# EAGLE schematic v1_0 (EAGLE 8.0.1)
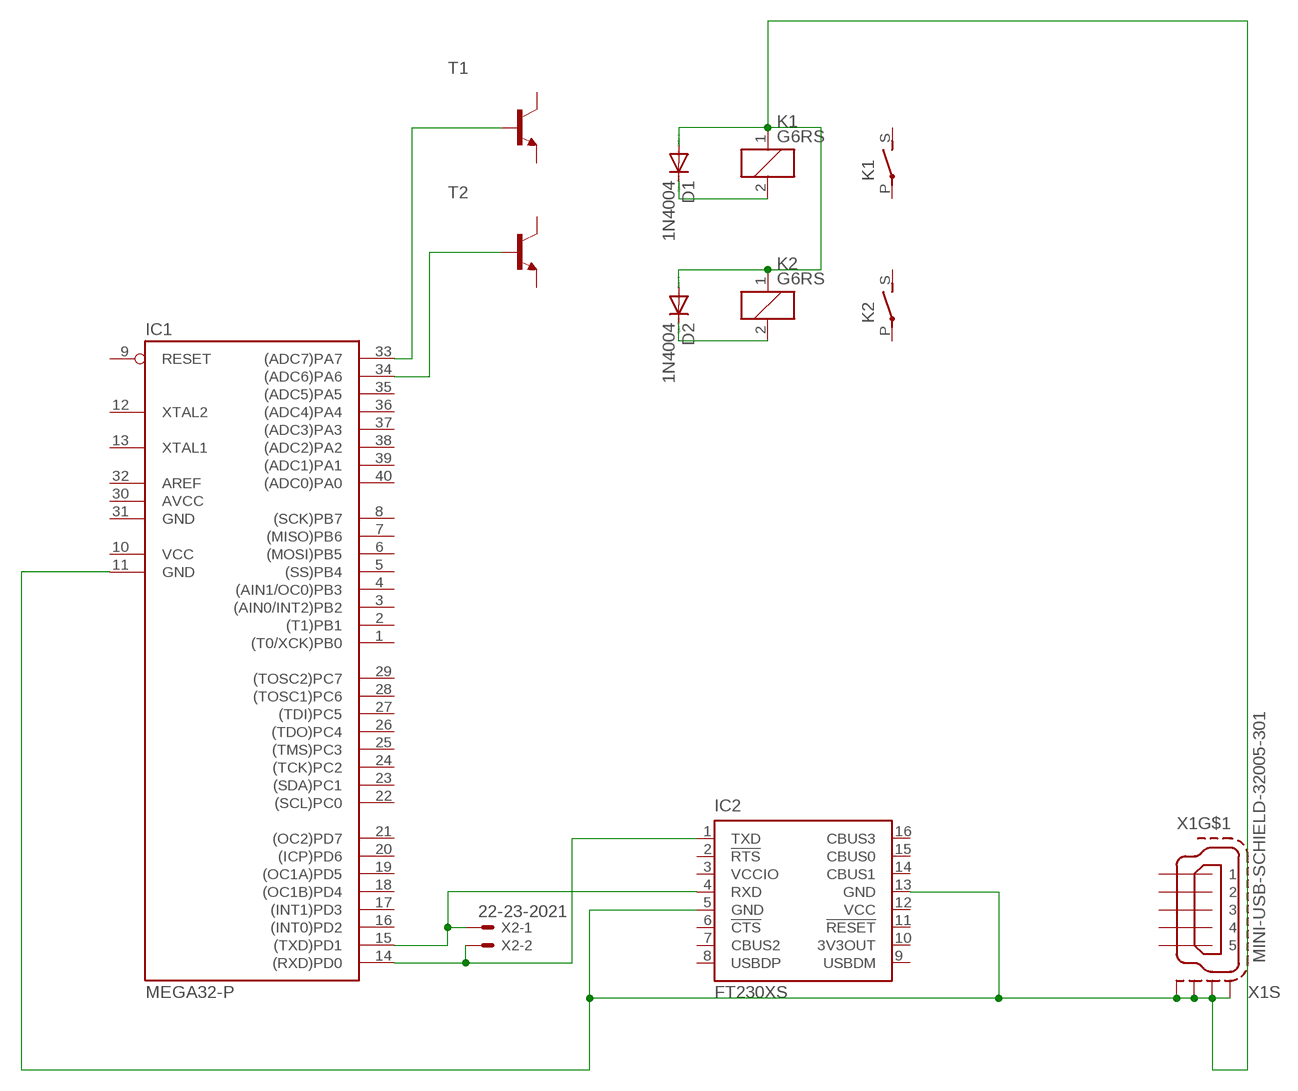
[diagram p0: schematic, sheet 1]

## Parts
D1  1N4004  [DO41-10]
D2  1N4004  [DO41-10]
IC1  MEGA32-P  [DIL40]
IC2  FT230XS  [SSOP16]
K1  G6RS  [G6RS]
K2  G6RS  [G6RS]
T1  BC547-NPN-TO92-CBE  [TO92-CBE]
T2  BC547-NPN-TO92-CBE  [TO92-CBE]
X1  MINI-USB-SCHIELD-32005-301  [32005-301]
X2  22-23-2021  [22-23-2021]

## Nets
N$1: IC1.14((RXD)PD0) IC2.1(TXD) X2.2
N$2: D1.A D2.A IC1.11(GND) IC2.5(GND) IC2.13(GND) K1.1 K2.1 X1.M1(S:S1) X1.M2(S:S2) X1.M3(S:S3) X1.M4(S:S4)
N$3: IC1.15((TXD)PD1) IC2.4(RXD) X2.1
N$4: IC1.33((ADC7)PA7) T1.B
N$5: D1.C K1.2
N$6: D2.C K2.2
N$7: IC1.34((ADC6)PA6) T2.B
Unconnected: IC1.1((T0/XCK)PB0) IC1.2((T1)PB1) IC1.3((AIN0/INT2)PB2) IC1.4((AIN1/OC0)PB3) IC1.5((SS)PB4) IC1.6((MOSI)PB5) IC1.7((MISO)PB6) IC1.8((SCK)PB7) IC1.9(RESET) IC1.12(XTAL2) IC1.13(XTAL1) IC1.16((INT0)PD2) IC1.17((INT1)PD3) IC1.18((OC1B)PD4) IC1.19((OC1A)PD5) IC1.20((ICP)PD6) IC1.21((OC2)PD7) IC1.22((SCL)PC0) IC1.23((SDA)PC1) IC1.24((TCK)PC2) IC1.25((TMS)PC3) IC1.26((TDO)PC4) IC1.27((TDI)PC5) IC1.28((TOSC1)PC6) IC1.29((TOSC2)PC7) IC1.32(AREF) IC1.35((ADC5)PA5) IC1.36((ADC4)PA4) IC1.37((ADC3)PA3) IC1.38((ADC2)PA2) IC1.39((ADC1)PA1) IC1.40((ADC0)PA0) IC2.2(!RTS) IC2.6(!CTS) IC2.7(CBUS2) IC2.8(USBDP) IC2.9(USBDM) IC2.10(3V3OUT) IC2.11(!RESET) IC2.14(CBUS1) IC2.15(CBUS0) IC2.16(CBUS3) K1.P(2:P) K1.S(2:S) K2.P(2:P) K2.S(2:S) T1.C T1.E T2.C T2.E X1.1 X1.2 X1.3 X1.4 X1.5

## Power pins joined to a net without a drawn wire
AVCC: IC1.30(AVCC)
GND: IC1.31(GND)
VCC: IC1.10(VCC) IC2.12(VCC)
VCCIO: IC2.3(VCCIO)

## Library data of the parts
D1 D2 = diode:1N4004: DIODE general purpose rectifier, 1 A
IC1 = atmel:MEGA32-P: MICROCONTROLLER 32 Kbytes FLASH 2 Kbytes SRAM 1 Kbytes EEPROM USART 8-channel 10 bit ADC Source: www.atmel.com .. doc2503.pdf; MPN: ATMEGA32-16PU; OC_FARNELL: 1661729; OC_NEWARK: 51P1794
IC2 = ftdichip:FT230X: USB to BASIC UART IC Auto generated by make-symbol-device-package-bsdl.ulp Rev. 43 Source: Data sheet <http://www.ftdichip.com/Support/Documents/DataSheets/ICs/DS_FT230X.pdf>
K1 K2 = relay:G6RS: RELAY 1 x norm. open, Omron; OC_FARNELL: unknown; OC_NEWARK: unknown
T1 T2 = transistor:*-NPN-: NPN Transistror BF959 corrected 2008.03.06
X1 = con-cypressindustries:MINI-USB-SCHIELD-: MINI USB-B Conector Source: www.cypressindustries.com; OC_FARNELL: unknown; OC_NEWARK: unknown
X2 = con-molex:22-23-2021: .100" (2.54mm) Center Header - 2 Pin; MF: MOLEX; MPN: 22-23-2021; OC_FARNELL: 1462926; OC_NEWARK: 25C3832